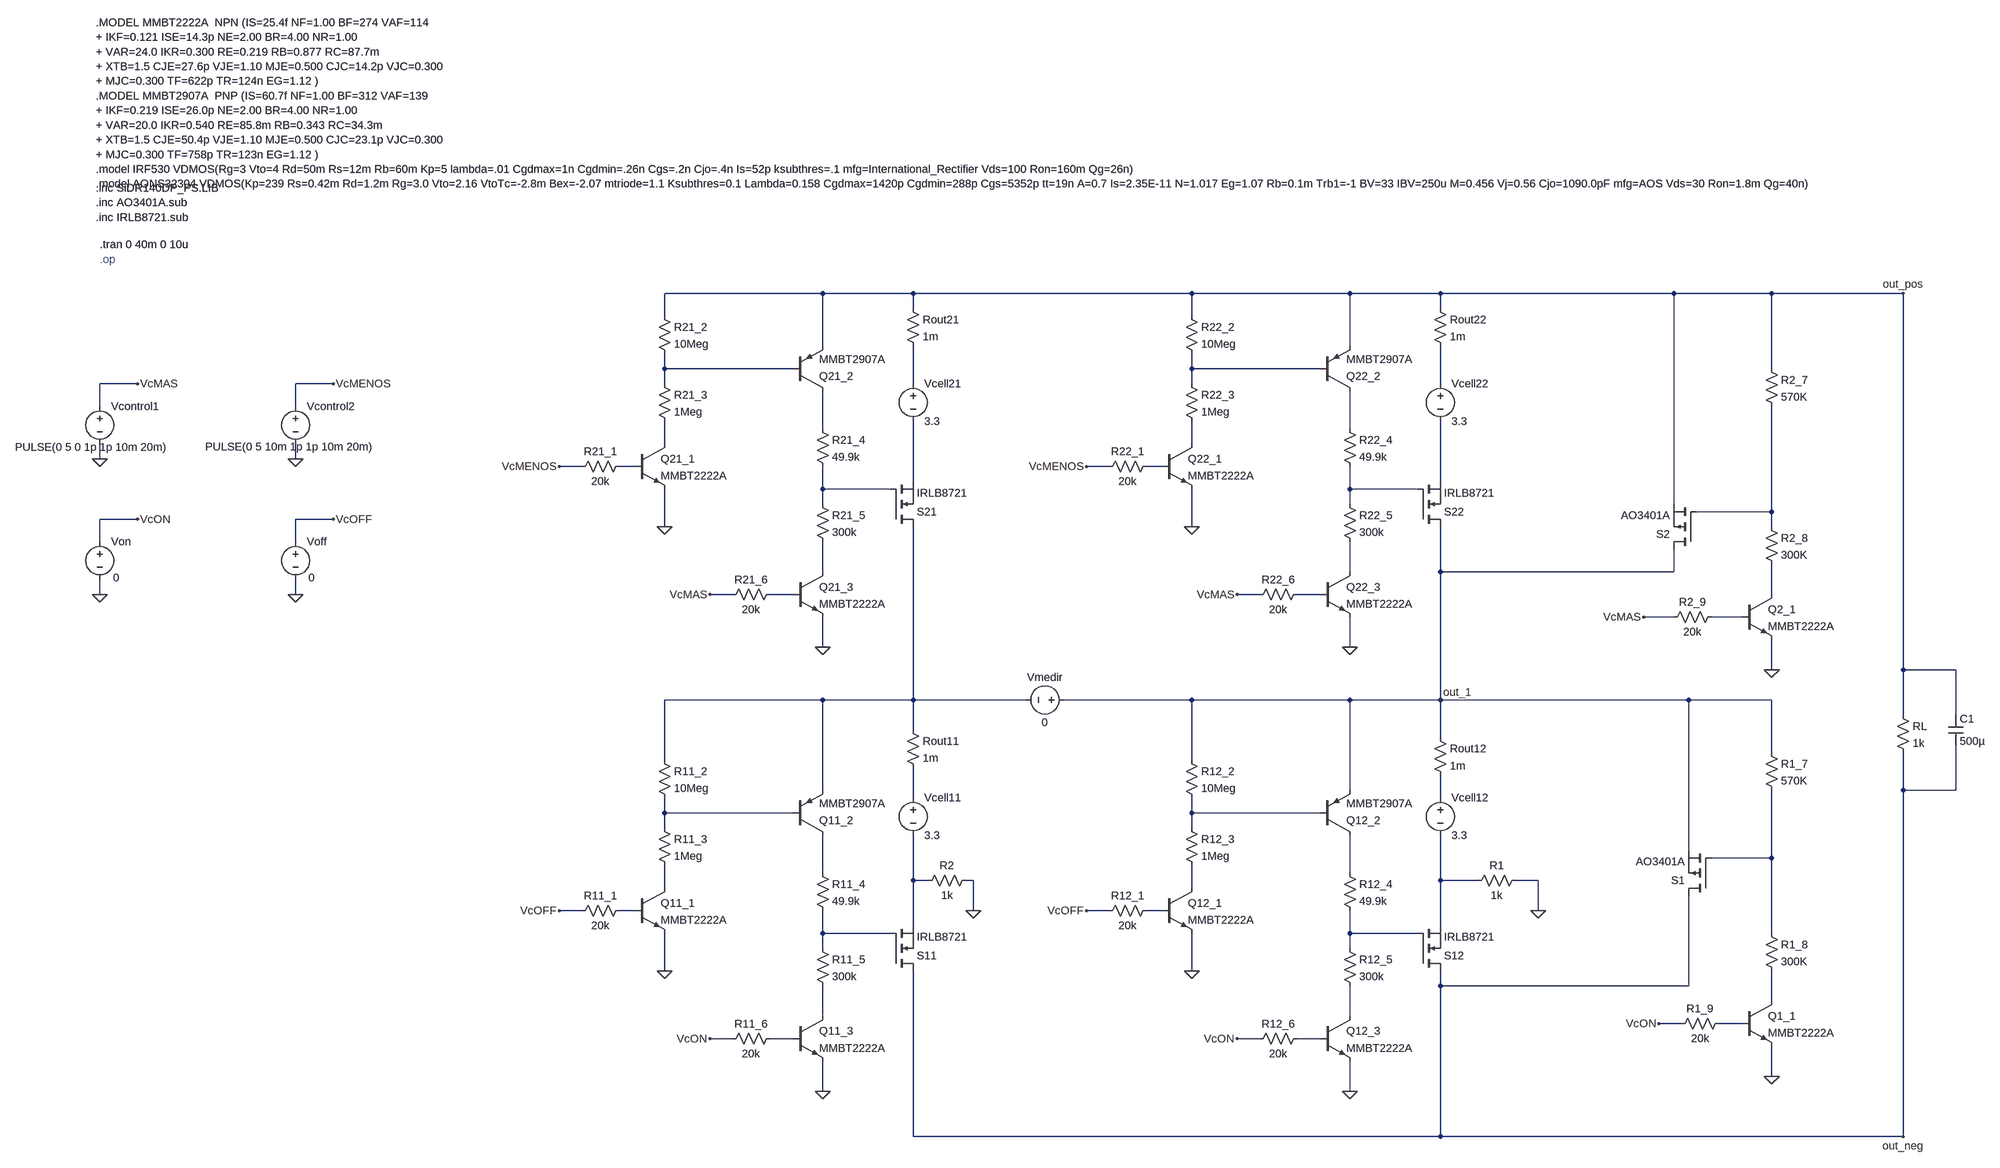
[diagram p0: schematic version2.0.asc]
version2.0.asc, the LTspice schematic file:
Version 4.1
SHEET 1 3872 1360
WIRE -592 -1232 -928 -1232
WIRE -400 -1232 -592 -1232
WIRE 192 -1232 -400 -1232
WIRE 528 -1232 192 -1232
WIRE 720 -1232 528 -1232
WIRE 1216 -1232 720 -1232
WIRE 1424 -1232 1216 -1232
WIRE 2800 -1232 1424 -1232
WIRE -400 -1200 -400 -1232
WIRE 720 -1200 720 -1232
WIRE -928 -1184 -928 -1232
WIRE 192 -1184 192 -1232
WIRE -592 -1120 -592 -1232
WIRE 528 -1120 528 -1232
WIRE -928 -1072 -928 -1104
WIRE -656 -1072 -928 -1072
WIRE 192 -1072 192 -1104
WIRE 464 -1072 192 -1072
WIRE 1424 -1072 1424 -1232
WIRE -2048 -1040 -2128 -1040
WIRE -1632 -1040 -1712 -1040
WIRE -928 -1040 -928 -1072
WIRE -400 -1040 -400 -1120
WIRE 192 -1040 192 -1072
WIRE 720 -1040 720 -1120
WIRE -2128 -992 -2128 -1040
WIRE -1712 -992 -1712 -1040
WIRE -592 -944 -592 -1024
WIRE 528 -944 528 -1024
WIRE -928 -912 -928 -960
WIRE 192 -912 192 -960
WIRE -2128 -880 -2128 -912
WIRE -1712 -880 -1712 -912
WIRE -1104 -864 -1152 -864
WIRE -992 -864 -1024 -864
WIRE 16 -864 -32 -864
WIRE 128 -864 96 -864
WIRE -400 -832 -400 -960
WIRE 720 -832 720 -960
WIRE -592 -816 -592 -864
WIRE -448 -816 -592 -816
WIRE 528 -816 528 -864
WIRE 672 -816 528 -816
WIRE -592 -784 -592 -816
WIRE 528 -784 528 -816
WIRE 1216 -784 1216 -1232
WIRE 1424 -768 1424 -992
WIRE 1424 -768 1264 -768
WIRE -2048 -752 -2128 -752
WIRE -1632 -752 -1712 -752
WIRE -928 -736 -928 -816
WIRE 192 -736 192 -816
WIRE 1424 -736 1424 -768
WIRE -2128 -704 -2128 -752
WIRE -1712 -704 -1712 -752
WIRE -592 -640 -592 -704
WIRE 528 -640 528 -704
WIRE 720 -640 720 -736
WIRE 1216 -640 1216 -688
WIRE 1216 -640 720 -640
WIRE -2128 -592 -2128 -624
WIRE -1712 -592 -1712 -624
WIRE -784 -592 -832 -592
WIRE -656 -592 -704 -592
WIRE 336 -592 288 -592
WIRE 464 -592 416 -592
WIRE 1424 -592 1424 -656
WIRE 1216 -544 1152 -544
WIRE 1360 -544 1296 -544
WIRE -592 -480 -592 -544
WIRE 528 -480 528 -544
WIRE 1424 -432 1424 -496
WIRE 2800 -432 2800 -1232
WIRE 2912 -432 2800 -432
WIRE -592 -368 -928 -368
WIRE -400 -368 -400 -736
WIRE -400 -368 -592 -368
WIRE -160 -368 -400 -368
WIRE 192 -368 -80 -368
WIRE 528 -368 192 -368
WIRE 720 -368 720 -640
WIRE 720 -368 528 -368
WIRE 1248 -368 720 -368
WIRE 1424 -368 1248 -368
WIRE 2800 -336 2800 -432
WIRE 2912 -336 2912 -432
WIRE -400 -304 -400 -368
WIRE 720 -288 720 -368
WIRE 1424 -256 1424 -368
WIRE -928 -240 -928 -368
WIRE 192 -240 192 -368
WIRE -592 -176 -592 -368
WIRE 528 -176 528 -368
WIRE 2800 -176 2800 -256
WIRE 2912 -176 2912 -272
WIRE 2912 -176 2800 -176
WIRE -400 -160 -400 -224
WIRE 720 -160 720 -208
WIRE -928 -128 -928 -160
WIRE -656 -128 -928 -128
WIRE 192 -128 192 -160
WIRE 464 -128 192 -128
WIRE -928 -96 -928 -128
WIRE 192 -96 192 -128
WIRE 1248 -48 1248 -368
WIRE 1424 -32 1424 -176
WIRE 1424 -32 1296 -32
WIRE -592 0 -592 -80
WIRE 528 0 528 -80
WIRE -400 16 -400 -80
WIRE -368 16 -400 16
WIRE -272 16 -288 16
WIRE 720 16 720 -80
WIRE 800 16 720 16
WIRE 928 16 880 16
WIRE -928 32 -928 -16
WIRE 192 32 192 -16
WIRE -1104 80 -1152 80
WIRE -992 80 -1024 80
WIRE -272 80 -272 16
WIRE 16 80 -32 80
WIRE 128 80 96 80
WIRE 928 80 928 16
WIRE -400 112 -400 16
WIRE 720 112 720 16
WIRE -592 128 -592 80
WIRE -448 128 -592 128
WIRE 528 128 528 80
WIRE 672 128 528 128
WIRE 1424 128 1424 -32
WIRE -592 160 -592 128
WIRE 528 160 528 128
WIRE -928 208 -928 128
WIRE 192 208 192 128
WIRE 720 240 720 208
WIRE 1248 240 1248 48
WIRE 1248 240 720 240
WIRE 1424 272 1424 208
WIRE -592 304 -592 240
WIRE 528 304 528 240
WIRE 1232 320 1184 320
WIRE 1360 320 1312 320
WIRE -784 352 -832 352
WIRE -656 352 -704 352
WIRE 336 352 288 352
WIRE 464 352 416 352
WIRE 1424 432 1424 368
WIRE -592 464 -592 400
WIRE 528 464 528 400
WIRE -400 560 -400 208
WIRE 720 560 720 240
WIRE 720 560 -400 560
WIRE 2800 560 2800 -176
WIRE 2800 560 720 560
FLAG -928 208 0
FLAG -592 464 0
FLAG -272 80 0
FLAG 192 208 0
FLAG 528 464 0
FLAG 928 80 0
FLAG -928 -736 0
FLAG -592 -480 0
FLAG 192 -736 0
FLAG 528 -480 0
FLAG -2128 -880 0
FLAG -1712 -880 0
FLAG -2048 -1040 VcMAS
FLAG -1632 -1040 VcMENOS
FLAG -1712 -592 0
FLAG -1632 -752 VcOFF
FLAG -2128 -592 0
FLAG -2048 -752 VcON
FLAG -832 352 VcON
FLAG -832 -592 VcMAS
FLAG 288 -592 VcMAS
FLAG 288 352 VcON
FLAG -1152 80 VcOFF
FLAG -1152 -864 VcMENOS
FLAG -32 -864 VcMENOS
FLAG -32 80 VcOFF
FLAG 2800 -1232 out_pos
FLAG 2800 560 out_neg
FLAG 720 -368 out_1
FLAG 1424 432 0
FLAG 1184 320 VcON
FLAG 1424 -432 0
FLAG 1152 -544 VcMAS
SYMBOL npn -656 304 R0
SYMATTR InstName Q11_3
SYMATTR Value MMBT2222A
SYMBOL res -608 144 R0
SYMATTR InstName R11_5
SYMATTR Value 300k
SYMBOL res -608 -16 R0
SYMATTR InstName R11_4
SYMATTR Value 49.9k
SYMBOL npn -992 32 R0
SYMATTR InstName Q11_1
SYMATTR Value MMBT2222A
SYMBOL res -944 -112 R0
SYMATTR InstName R11_3
SYMATTR Value 1Meg
SYMBOL res -944 -256 R0
SYMATTR InstName R11_2
SYMATTR Value 10Meg
SYMBOL res -688 336 R90
WINDOW 0 0 56 VBottom 2
WINDOW 3 32 56 VTop 2
SYMATTR InstName R11_6
SYMATTR Value 20k
SYMBOL voltage -400 -176 R0
WINDOW 123 0 0 Left 0
WINDOW 39 0 0 Left 0
SYMATTR InstName Vcell11
SYMATTR Value 3.3
SYMBOL pnp -656 -80 M180
SYMATTR InstName Q11_2
SYMATTR Value MMBT2907A
SYMBOL nmos -448 208 M180
SYMATTR InstName S11
SYMATTR Value IRLB8721
SYMATTR Prefix x
SYMBOL npn 464 304 R0
SYMATTR InstName Q12_3
SYMATTR Value MMBT2222A
SYMBOL res 512 144 R0
SYMATTR InstName R12_5
SYMATTR Value 300k
SYMBOL res 512 -16 R0
SYMATTR InstName R12_4
SYMATTR Value 49.9k
SYMBOL npn 128 32 R0
SYMATTR InstName Q12_1
SYMATTR Value MMBT2222A
SYMBOL res 176 -112 R0
SYMATTR InstName R12_3
SYMATTR Value 1Meg
SYMBOL res 176 -256 R0
SYMATTR InstName R12_2
SYMATTR Value 10Meg
SYMBOL res 432 336 R90
WINDOW 0 0 56 VBottom 2
WINDOW 3 32 56 VTop 2
SYMATTR InstName R12_6
SYMATTR Value 20k
SYMBOL voltage 720 -176 R0
WINDOW 123 0 0 Left 0
WINDOW 39 0 0 Left 0
SYMATTR InstName Vcell12
SYMATTR Value 3.3
SYMBOL pnp 464 -80 M180
SYMATTR InstName Q12_2
SYMATTR Value MMBT2907A
SYMBOL nmos 672 208 M180
SYMATTR InstName S12
SYMATTR Value IRLB8721
SYMATTR Prefix X
SYMBOL npn -656 -640 R0
SYMATTR InstName Q21_3
SYMATTR Value MMBT2222A
SYMBOL res -608 -800 R0
SYMATTR InstName R21_5
SYMATTR Value 300k
SYMBOL res -608 -960 R0
SYMATTR InstName R21_4
SYMATTR Value 49.9k
SYMBOL npn -992 -912 R0
SYMATTR InstName Q21_1
SYMATTR Value MMBT2222A
SYMBOL res -944 -1056 R0
SYMATTR InstName R21_3
SYMATTR Value 1Meg
SYMBOL res -944 -1200 R0
SYMATTR InstName R21_2
SYMATTR Value 10Meg
SYMBOL res -688 -608 R90
WINDOW 0 0 56 VBottom 2
WINDOW 3 32 56 VTop 2
SYMATTR InstName R21_6
SYMATTR Value 20k
SYMBOL voltage -400 -1056 R0
WINDOW 123 0 0 Left 0
WINDOW 39 0 0 Left 0
SYMATTR InstName Vcell21
SYMATTR Value 3.3
SYMBOL pnp -656 -1024 M180
SYMATTR InstName Q21_2
SYMATTR Value MMBT2907A
SYMBOL nmos -448 -736 M180
SYMATTR InstName S21
SYMATTR Value IRLB8721
SYMATTR Prefix X
SYMBOL npn 464 -640 R0
SYMATTR InstName Q22_3
SYMATTR Value MMBT2222A
SYMBOL res 512 -800 R0
SYMATTR InstName R22_5
SYMATTR Value 300k
SYMBOL res 512 -960 R0
SYMATTR InstName R22_4
SYMATTR Value 49.9k
SYMBOL npn 128 -912 R0
SYMATTR InstName Q22_1
SYMATTR Value MMBT2222A
SYMBOL res 176 -1056 R0
SYMATTR InstName R22_3
SYMATTR Value 1Meg
SYMBOL res 176 -1200 R0
SYMATTR InstName R22_2
SYMATTR Value 10Meg
SYMBOL res 432 -608 R90
WINDOW 0 0 56 VBottom 2
WINDOW 3 32 56 VTop 2
SYMATTR InstName R22_6
SYMATTR Value 20k
SYMBOL voltage 720 -1056 R0
WINDOW 123 0 0 Left 0
WINDOW 39 0 0 Left 0
SYMATTR InstName Vcell22
SYMATTR Value 3.3
SYMBOL pnp 464 -1024 M180
SYMATTR InstName Q22_2
SYMATTR Value MMBT2907A
SYMBOL nmos 672 -736 M180
SYMATTR InstName S22
SYMATTR Value IRLB8721
SYMATTR Prefix X
SYMBOL voltage -2128 -1008 R0
WINDOW 3 -180 103 Left 2
WINDOW 123 0 0 Left 0
WINDOW 39 0 0 Left 0
SYMATTR Value PULSE(0 5 0 1p 1p 10m 20m)
SYMATTR InstName Vcontrol1
SYMBOL voltage -1712 -1008 R0
WINDOW 3 -192 102 Left 2
WINDOW 123 0 0 Left 0
WINDOW 39 0 0 Left 0
SYMATTR Value PULSE(0 5 10m 1p 1p 10m 20m)
SYMATTR InstName Vcontrol2
SYMBOL voltage -1712 -720 R0
WINDOW 3 27 92 Left 2
WINDOW 123 0 0 Left 0
WINDOW 39 0 0 Left 0
SYMATTR Value 0
SYMATTR InstName Voff
SYMBOL voltage -2128 -720 R0
WINDOW 3 28 92 Left 2
WINDOW 123 0 0 Left 0
WINDOW 39 0 0 Left 0
SYMATTR Value 0
SYMATTR InstName Von
SYMBOL res -1008 64 R90
WINDOW 0 0 56 VBottom 2
WINDOW 3 32 56 VTop 2
SYMATTR InstName R11_1
SYMATTR Value 20k
SYMBOL res -1008 -880 R90
WINDOW 0 0 56 VBottom 2
WINDOW 3 32 56 VTop 2
SYMATTR InstName R21_1
SYMATTR Value 20k
SYMBOL res 112 -880 R90
WINDOW 0 0 56 VBottom 2
WINDOW 3 32 56 VTop 2
SYMATTR InstName R22_1
SYMATTR Value 20k
SYMBOL res 112 64 R90
WINDOW 0 0 56 VBottom 2
WINDOW 3 32 56 VTop 2
SYMATTR InstName R12_1
SYMATTR Value 20k
SYMBOL res 2784 -352 R0
SYMATTR InstName RL
SYMATTR Value 1k
SYMBOL res 704 -304 R0
SYMATTR InstName Rout12
SYMATTR Value 1m
SYMBOL res -416 -320 R0
SYMATTR InstName Rout11
SYMATTR Value 1m
SYMBOL res -416 -1216 R0
SYMATTR InstName Rout21
SYMATTR Value 1m
SYMBOL res 704 -1216 R0
SYMATTR InstName Rout22
SYMATTR Value 1m
SYMBOL voltage -64 -368 R90
WINDOW 0 -32 56 VBottom 2
WINDOW 3 32 56 VTop 2
WINDOW 123 0 0 Left 0
WINDOW 39 0 0 Left 0
SYMATTR InstName Vmedir
SYMATTR Value 0
SYMBOL npn 1360 272 R0
SYMATTR InstName Q1_1
SYMATTR Value MMBT2222A
SYMBOL res 1328 304 R90
WINDOW 0 0 56 VBottom 2
WINDOW 3 32 56 VTop 2
SYMATTR InstName R1_9
SYMATTR Value 20k
SYMBOL res 1408 112 R0
SYMATTR InstName R1_8
SYMATTR Value 300K
SYMBOL res 1408 -272 R0
SYMATTR InstName R1_7
SYMATTR Value 570K
SYMBOL npn 1360 -592 R0
SYMATTR InstName Q2_1
SYMATTR Value MMBT2222A
SYMBOL res 1312 -560 R90
WINDOW 0 0 56 VBottom 2
WINDOW 3 32 56 VTop 2
SYMATTR InstName R2_9
SYMATTR Value 20k
SYMBOL res 1408 -752 R0
SYMATTR InstName R2_8
SYMATTR Value 300K
SYMBOL res 1408 -1088 R0
SYMATTR InstName R2_7
SYMATTR Value 570K
SYMBOL pmos 1296 48 R180
SYMATTR InstName S1
SYMATTR Value AO3401A
SYMATTR Prefix X
SYMBOL pmos 1264 -688 R180
SYMATTR InstName S2
SYMATTR Value AO3401A
SYMATTR Prefix X
SYMBOL res 896 0 R90
WINDOW 0 0 56 VBottom 2
WINDOW 3 32 56 VTop 2
SYMATTR InstName R1
SYMATTR Value 1k
SYMBOL res -272 0 R90
WINDOW 0 0 56 VBottom 2
WINDOW 3 32 56 VTop 2
SYMATTR InstName R2
SYMATTR Value 1k
SYMBOL cap 2896 -336 R0
SYMATTR InstName C1
SYMATTR Value 500µ
TEXT -2128 -1336 Left 2 !.tran 0 40m 0 10u
TEXT -2136 -1808 Left 2 !.MODEL MMBT2222A  NPN (IS=25.4f NF=1.00 BF=274 VAF=114 \n+ IKF=0.121 ISE=14.3p NE=2.00 BR=4.00 NR=1.00 \n+ VAR=24.0 IKR=0.300 RE=0.219 RB=0.877 RC=87.7m \n+ XTB=1.5 CJE=27.6p VJE=1.10 MJE=0.500 CJC=14.2p VJC=0.300 \n+ MJC=0.300 TF=622p TR=124n EG=1.12 )\n.MODEL MMBT2907A  PNP (IS=60.7f NF=1.00 BF=312 VAF=139 \n+ IKF=0.219 ISE=26.0p NE=2.00 BR=4.00 NR=1.00 \n+ VAR=20.0 IKR=0.540 RE=85.8m RB=0.343 RC=34.3m \n+ XTB=1.5 CJE=50.4p VJE=1.10 MJE=0.500 CJC=23.1p VJC=0.300 \n+ MJC=0.300 TF=758p TR=123n EG=1.12 )\n.model IRF530 VDMOS(Rg=3 Vto=4 Rd=50m Rs=12m Rb=60m Kp=5 lambda=.01 Cgdmax=1n Cgdmin=.26n Cgs=.2n Cjo=.4n Is=52p ksubthres=.1 mfg=International_Rectifier Vds=100 Ron=160m Qg=26n)\n.model AONS32304 VDMOS(Kp=239 Rs=0.42m Rd=1.2m Rg=3.0 Vto=2.16 VtoTc=-2.8m Bex=-2.07 mtriode=1.1 Ksubthres=0.1 Lambda=0.158 Cgdmax=1420p Cgdmin=288p Cgs=5352p tt=19n A=0.7 Is=2.35E-11 N=1.017 Eg=1.07 Rb=0.1m Trb1=-1 BV=33 IBV=250u M=0.456 Vj=0.56 Cjo=1090.0pF mfg=AOS Vds=30 Ron=1.8m Qg=40n)
TEXT -2136 -1456 Left 2 !.inc SiDR140DP_PS.LIB\n.inc AO3401A.sub\n.inc IRLB8721.sub
TEXT -2128 -1304 Left 2 ;.op

The netlist it stands for:
* version2.0.asc
Q11_3 N039 N042 0 0 MMBT2222A
R11_5 N036 N039 300k
R11_4 N028 N036 49.9k
Q11_1 N032 N034 0 0 MMBT2222A
R11_3 N025 N032 1Meg
R11_2 N022 N025 10Meg
R11_6 N042 VcON 20k
Vcell11 N023 N030 3.3
Q11_2 N028 N025 N022 0 MMBT2907A
X§S11 out_neg N036 N030 IRLB8721  ; pins D G S
Q12_3 N040 N043 0 0 MMBT2222A
R12_5 N037 N040 300k
R12_4 N029 N037 49.9k
Q12_1 N033 N035 0 0 MMBT2222A
R12_3 N026 N033 1Meg
R12_2 out_1 N026 10Meg
R12_6 N043 VcON 20k
Vcell12 N024 N031 3.3
Q12_2 N029 N026 out_1 0 MMBT2907A
X§S12 out_neg N037 N031 IRLB8721  ; pins D G S
Q21_3 N016 N018 0 0 MMBT2222A
R21_5 N013 N016 300k
R21_4 N005 N013 49.9k
Q21_1 N007 N009 0 0 MMBT2222A
R21_3 N001 N007 1Meg
R21_2 out_pos N001 10Meg
R21_6 N018 VcMAS 20k
Vcell21 N003 N011 3.3
Q21_2 N005 N001 out_pos 0 MMBT2907A
X§S21 N022 N013 N011 IRLB8721  ; pins D G S
Q22_3 N017 N019 0 0 MMBT2222A
R22_5 N014 N017 300k
R22_4 N006 N014 49.9k
Q22_1 N008 N010 0 0 MMBT2222A
R22_3 N002 N008 1Meg
R22_2 out_pos N002 10Meg
R22_6 N019 VcMAS 20k
Vcell22 N004 N012 3.3
Q22_2 N006 N002 out_pos 0 MMBT2907A
X§S22 out_1 N014 N012 IRLB8721  ; pins D G S
Vcontrol1 VcMAS 0 PULSE(0 5 0 1p 1p 10m 20m)
Vcontrol2 VcMENOS 0 PULSE(0 5 10m 1p 1p 10m 20m)
Voff VcOFF 0 0
Von VcON 0 0
R11_1 N034 VcOFF 20k
R21_1 N009 VcMENOS 20k
R22_1 N010 VcMENOS 20k
R12_1 N035 VcOFF 20k
RL out_pos out_neg 1k
Rout12 out_1 N024 1m
Rout11 N022 N023 1m
Rout21 out_pos N003 1m
Rout22 out_pos N004 1m
Vmedir out_1 N022 0
Q1_1 N038 N041 0 0 MMBT2222A
R1_9 N041 VcON 20k
R1_8 N027 N038 300K
R1_7 out_1 N027 570K
Q2_1 N020 N021 0 0 MMBT2222A
R2_9 N021 VcMAS 20k
R2_8 N015 N020 300K
R2_7 out_pos N015 570K
X§S1 out_neg N027 out_1 AO3401A  ; pins D G S
X§S2 out_1 N015 out_pos AO3401A  ; pins D G S
R1 0 N031 1k
R2 0 N030 1k
C1 out_pos out_neg 500µ
.model NPN NPN
.model PNP PNP
.lib standard.bjt
.tran 0 40m 0 10u
.MODEL MMBT2222A  NPN (IS=25.4f NF=1.00 BF=274 VAF=114
+ IKF=0.121 ISE=14.3p NE=2.00 BR=4.00 NR=1.00
+ VAR=24.0 IKR=0.300 RE=0.219 RB=0.877 RC=87.7m
+ XTB=1.5 CJE=27.6p VJE=1.10 MJE=0.500 CJC=14.2p VJC=0.300
+ MJC=0.300 TF=622p TR=124n EG=1.12 )
.MODEL MMBT2907A  PNP (IS=60.7f NF=1.00 BF=312 VAF=139
+ IKF=0.219 ISE=26.0p NE=2.00 BR=4.00 NR=1.00
+ VAR=20.0 IKR=0.540 RE=85.8m RB=0.343 RC=34.3m
+ XTB=1.5 CJE=50.4p VJE=1.10 MJE=0.500 CJC=23.1p VJC=0.300
+ MJC=0.300 TF=758p TR=123n EG=1.12 )
.model IRF530 VDMOS(Rg=3 Vto=4 Rd=50m Rs=12m Rb=60m Kp=5 lambda=.01 Cgdmax=1n Cgdmin=.26n Cgs=.2n Cjo=.4n Is=52p ksubthres=.1 mfg=International_Rectifier Vds=100 Ron=160m Qg=26n)
.model AONS32304 VDMOS(Kp=239 Rs=0.42m Rd=1.2m Rg=3.0 Vto=2.16 VtoTc=-2.8m Bex=-2.07 mtriode=1.1 Ksubthres=0.1 Lambda=0.158 Cgdmax=1420p Cgdmin=288p Cgs=5352p tt=19n A=0.7 Is=2.35E-11 N=1.017 Eg=1.07 Rb=0.1m Trb1=-1 BV=33 IBV=250u M=0.456 Vj=0.56 Cjo=1090.0pF mfg=AOS Vds=30 Ron=1.8m Qg=40n)
.inc SiDR140DP_PS.LIB
.inc AO3401A.sub
.inc IRLB8721.sub
* .op
.backanno
.end